# Altium schematic sheet Sheet1.SchDoc
size A
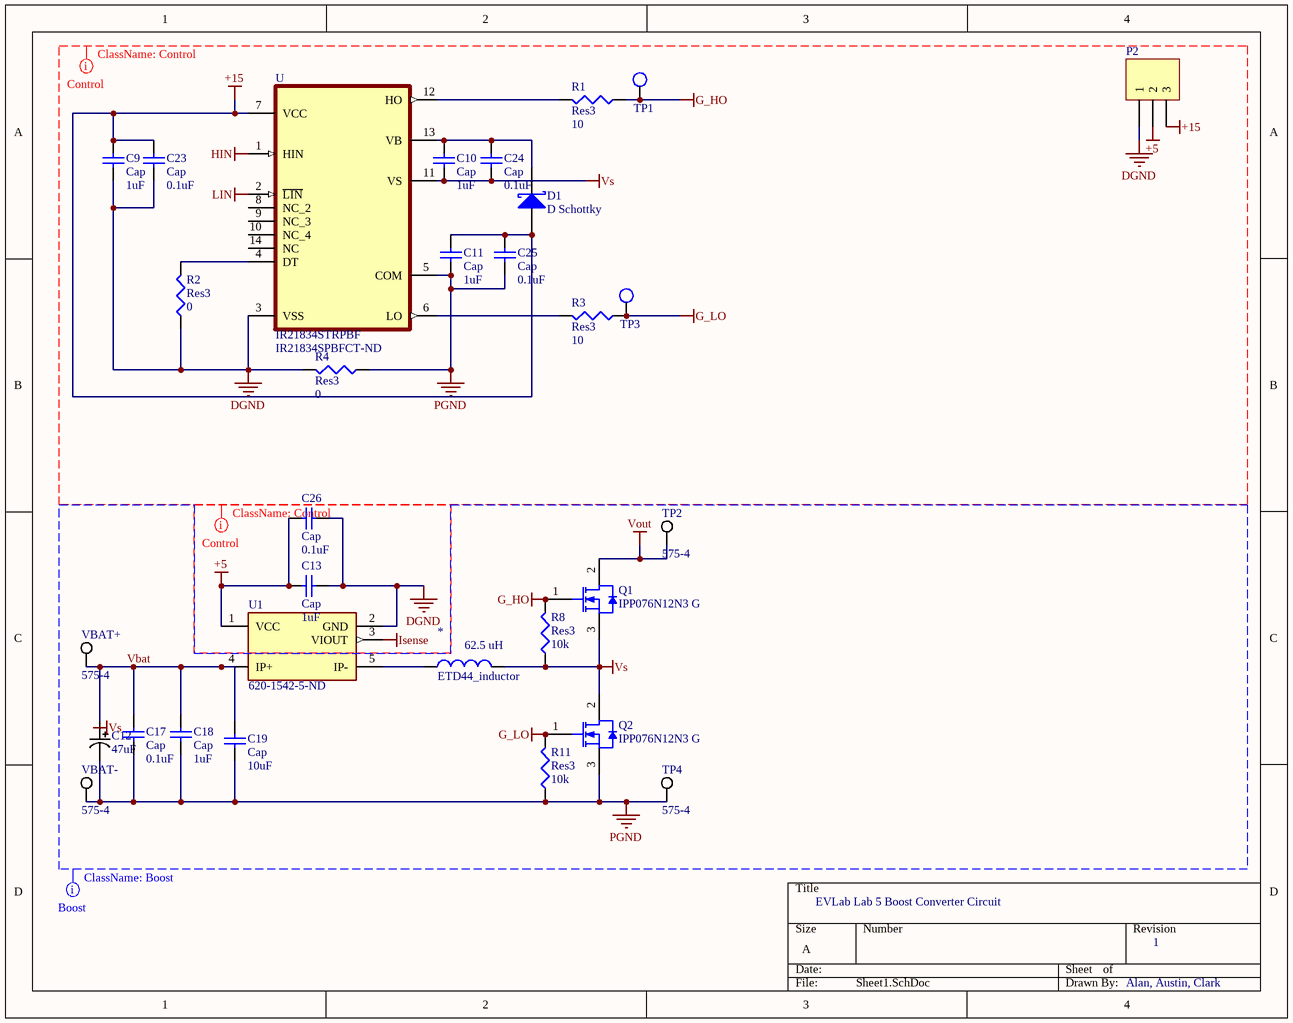
[diagram p0: Sheet1.SchDoc]

## Parts
*  ETD44_inductor  [ETD44]
C9  Cap  value 1uF  [C0603]
C10  Cap  value 1uF  [C0603]
C11  Cap  value 1uF  [C0603]
C12  47uF  [CAP_PC_10X10]
C13  Cap  value 1uF  [C0603]
C17  Cap  value 0.1uF  [C0603]
C18  Cap  value 1uF  [C0603]
C19  Cap  value 10uF  [C0603]
C23  Cap  value 0.1uF  [C0603]
C24  Cap  value 0.1uF  [C0603]
C25  Cap  value 0.1uF  [C0603]
C26  Cap  value 0.1uF  [C0603]
D1  D Schottky  [SMB]
P2  MHDR1X3  [MHDR1X3]  (value not drawn)
Q1  IPP076N12N3 G  [INF-PG-TO220-3-1_A_V]
Q2  IPP076N12N3 G  [INF-PG-TO220-3-1_A_V]
R1  Res3  value 10  [J1-0603]
R2  Res3  value 0  [J1-0603]
R3  Res3  value 10  [J1-0603]
R4  Res3  value 0  [J1-0603]
R8  Res3  value 10k  [J1-0603]
R11  Res3  value 10k  [J1-0603]
TP1  Test Point  [Test Point - TH]  (value not drawn)
TP2  575-4  [KSTN-575-4]
TP3  Test Point  [Test Point - TH]  (value not drawn)
TP4  575-4  [KSTN-575-4]
U  IR21834STRPBF  Supplier Part Number 3: IR21834SPBFCT-ND  [SOIC127P600X175-14N]
U1  Supplier Part Number 1: 620-1542-5-ND  [Allegro_MicroSystems_CB-PFF-5_0]  (hidden comment: ACS770KCB-150B-PFF-T)
VBAT+  575-4  [KSTN-575-4]
VBAT-  575-4  [KSTN-575-4]

## Nets
+5: C13.2 C26.2 P2.2 U1.1(VCC)
+15: C9.2 C11.2 C23.1 C25.1 D1.1(A) P2.3 U.7(VCC)
DGND: C9.1 C13.1 C23.2 C26.1 P2.1 R2.1 R4.2 U.3(VSS) U1.2(GND)
G_HO: Q1.1(GATE) R1.1 R8.2 TP1.1
G_LO: Q2.1(GATE) R3.1 R11.2 TP3.1
HIN: U.1(HIN)
Isense: U1.3(VIOUT)
LIN: U.2(~{LIN})
PGND: C11.1 C12.2 C17.1 C18.1 C19.1 C25.2 Q2.3(SOURCE) R4.1 R11.1 TP4.1 U.5(COM) VBAT-.1
Vout: Q1.2(DRAIN) TP2.1
Vs: *.2 C10.1 C24.2 Q1.3(SOURCE) Q2.2(DRAIN) R8.1 U.11(VS)
Vbat: C12.1 C17.2 C18.2 C19.2 U1.4(IP+) VBAT+.1
Net*_1: *.1 U1.5(IP-)
NetC10_2: C10.2 C24.1 D1.2(K) U.13(VB)
NetR1_2: R1.2 U.12(HO)
NetR2_2: R2.2 U.4(DT)
NetR3_2: R3.2 U.6(LO)

Not connected (* = marked no-connect by the designer): U 8(NC_2) 9(NC_3) 10(NC_4) 14(NC)

## Layout directives
net class Control: +5, +15, DGND, G_HO, G_LO, HIN, LIN, PGND, Vs
net class Boost: G_HO, G_LO, PGND, Vbat, Vout, Vs

## Notes on the sheet
- EVLab Lab 5 Boost Converter Circuit
- 1
- Alan, Austin, Clark
- Labels drawn without touching a wire or pin: Vs
- (in symbol ETD44_inductor) 62.5 uH

## Library data of the parts
C9-C11 C13 C17-C19 C23-C26 = Cap: Capacitor; Published: 8-Jun-2000; LatestRevisionDate: 17-Jul-2002; LatestRevisionNote: Re-released for DXP Platform.; PackageReference: RAD-0.3; Publisher: Altium Limited; PackageDescription: Radial Cap, Thru-Hole; 2 Leads; 0.3 in Pin Spacing
C12 = A767MU476M1KLAE040: CAP ALUM POLY 47UF 20% 80V SMD; Manufacturer_Part_Number: KEMET; Vendor: Nichicon; Built_By: EMA_Cory; Type: DEV; ESR (Equivalent Series Resistance): 40mR; Life (Hours): 2000Hour; Copyright: Copyright (C) 2018 Accelerated Designs. All rights reserved; RefDes: RefDes; Value: Value; Supplier 1: Digi-Key; Manufacturer: KEMET; Manufacturer Part Number: A767MU476M1KLAE040; RoHS: No; Stock 1: 1540; Pricing 1: 1=3.12000, 10=2.52600, 100=1.92890 (USD); Mount: Surface Mount; Case/Package: Radial; Min Operating Temperature: -55°C; Max Operating Temperature: 105°C; Packaging: Tape and Reel; Capacitance: 47uF; Tolerance: 20%; Voltage Rating: 80V; ComponentLink1URL: https://api.kemet.com/component-edge/download/datasheet/A767MU476M1KLAE040.pdf?src-supplier=Digi-Key; ComponentLink1Description: https://api.kemet.com/component-edge/download/datasheet/A767MU476M1KLAE040.pdf?src-supplier=Digi-Key; Supplier Part Number 1: 399-15651-1-ND; Category: Capacitors; ComponentLink2Description: SupplierDigikey; ComponentLink2URL: https://www.digikey.com/product-detail/en/kemet/A767MU476M1KLAE040/399-15651-6-ND/7392929
D1 = D Schottky: Schottky Diode; Published: 8-Jun-2000; LatestRevisionDate: 17-Jul-2002; LatestRevisionNote: Re-released for DXP Platform.; PackageReference: SMB; Publisher: Altium Limited; PackageDescription: DO-214-AA/SMB; 2 C-Bend Leads; Body 5.3 x 3.6 mm, inc. leads (LxW); Code_JEDEC: DO-214-AA
P2 = MHDR1X3: Header, 3-Pin; LatestRevisionDate: 17-Jul-2002; LatestRevisionNote: Re-released for DXP Platform.; Publisher: Altium Limited
Q1 Q2 = IPP076N12N3 G: N-Channel OptiMOS 3 Power-Transistor, 120 V VDS, 100 A ID, -55 to 175 degC, PG-TO220-3-1, Tube, Green; Manufacturer: Infineon; Green: TRUE; ID (max): 100 A; IDpuls (max): 400 A; Polarity: N; Ptot (max): 188 W; QG: 76 nC; RDS (on) (max): 7.6 mOhm; Rth: 0.8 K/W; RthJA (max): 62 K/W; VDS (max): 120 V; VGS(th) (max): 4 V; VGS(th) (min): 2 V; DatasheetVersion: Rev. 2.3; PackageVersion: Rev. 05, 08/2007; PackageReference: PG-TO220-3-1; PackageDescription: 3-Pin Plastic (Green) Transistor Single Outline Package, 10.03 x 8.98 mm Body, 2.54 mm Pitch; Supplier 1: Mouser; Supplier Part Number 1: 726-IPP076N12N3GXK; Supplier 2: Digi-Key; Supplier Part Number 2: IPP076N12N3 G-ND; Halogen-free: TRUE; Packing: Tube; RthJC (max): 0.8 K/W; Mounting Technology: Through Hole; PartNumber: IPP076N12N3 G; ComponentLink1Description: Manufacturer URL; ComponentLink1URL: http://www.infineon.com/; ComponentLink2Description: Datasheet; ComponentLink2URL: http://www.infineon.com/dgdl/IPP_I076N12N3+G_Rev2.3.pdf?folderId=db3a304313b8b5a60113cee8763b02d7&fileId=db3a30432239cccd0122a77a83ab7cd4; ComponentLink3Description: Package Specification; ComponentLink3URL: http://www.infineon.com/dgdl/IPP028N08N3_Rev1%5B1%5D.0.pdf?folderId=db3a304313b8b5a60113cee8763b02d7&fileId=db3a30432313ff5e0123a3c08e7326b5
R1-R4 R8 R11 = Res3: Resistor; Published: 8-Jun-2000; LatestRevisionDate: 29-May-2009; LatestRevisionNote: IPC-7351 Footprint Added.; PackageReference: J1-0603; Publisher: Altium Limited; PackageDescription: Chip Resistor
TP2 TP4 VBAT+ VBAT- = CMP-2000-05649-1: Banana Jack, Non-Insulated, 1-Pin THD, RoHS, Bulk; Manufacturer: Keystone-Electronics; Package Version: Rev. B, 11/1994; Plug/Mating Plug Diameter: StandardBanana; Gender: Female; Package Reference: 575-4; Operating Temperature: -; Contact Material: Brass; Packaging: Bulk; Series: -; Category: Connectors,Interconnects; Color: -; Type: BananaJack; Contact Finish: Nickel; Features: -; Family: BananaandTipConnectors-Jacks,Plugs; Body Material: -; Manufacturer URL: http://www.keyelco.com/; Termination: Solder; Insulation: Non-Insulated; Datasheet Version: Rev. B, 11/1994; Mounting Technology: ThroughHole; Package URL: http://www.keyelco.com/product-pdf.cfm?p=2379; Mounting Type: ThroughHole; Package Description: 1-Pin Through Hole Device, Dia 7.92 mm; Datasheet URL: http://www.keyelco.com/product-pdf.cfm?p=2379; Wire Gauge: -; ComponentLink1Description: SupplierDigikey; ComponentLink1URL: https://www.digikey.com/product-detail/en/keystone-electronics/575-4/36-575-4-ND/318493
U = IR21834STRPBF: INTERNATIONAL RECTIFIER   IR21834STRPBF   MOSFET DRIVER, HALF BRIDGE, SOIC-14, FULL REEL; Manufacturer Part Number: IR2183STRPBF; MF: Infineon Technologies; Turn-On Delay Time: 35ns; Max Supply Voltage: 20V; Min Supply Voltage: 10V; Number of Outputs: 2; Turn-Off Delay Time: 220ns; Power Dissipation: 625mW; Max Supply Current: 1.6mA; Max Output Current: 2.3A; Rise Time: 60ns; Propagation Delay: 330ns; Output Current: 1.9A; Nominal Supply Current: 1mA; Digi-Key_Purchase_URL: https://www.digikey.com/product-detail/en/infineon-technologies/IR21834STRPBF/IR21834SPBFCT-ND/827949?utm_source=snapeda&utm_medium=aggregator&utm_campaign=symbol; SnapEDA_Link: https://www.snapeda.com/parts/IR21834STRPBF/Infineon%20Technologies/view-part/528919/?ref=snap; MP: IR21834STRPBF; Digi-Key_Part_Number: IR21834SPBFCT-ND; Value: *; Package: SOIC-14 Infineon; Supplier 1: Digi-Key; Manufacturer: International Rectifier; RoHS: Yes; Category: MOSFETs; Stock 1: 12591; Pricing 1: 1=3.18000, 10=2.85300, 25=2.69760, 100=2.21800, 250=1.99016, 500=1.91824, 1000=1.59454 (USD); Mount: Surface Mount; Case/Package: SOIC; Number of Pins: 8; Weight: 0.019048oz; Min Operating Temperature: -40°C; Max Operating Temperature: 125°C; Number of Drivers: 2; Fall Time: 35ns; Packaging: Tape and Reel; Max Power Dissipation: 625mW; Package Quantity: 1; Operating Supply Current: 1.6mA; Radiation Hardening: No; REACH SVHC: No SVHC; Supplier 2: Digi-Key; Stock 2: 6093; Pricing 2: 1=3.19000, 10=2.86600, 25=2.70960, 100=2.22780, 250=1.99896, 500=1.92672, 1000=1.60159 (USD); Output Voltage: 20V; Length: 8.74mm; Height: 1.5mm; Width: 3.99mm; Supplier 3: Digi-Key; ComponentLink1Description: SupplierDigikey; ComponentLink1URL: https://www.digikey.com/product-detail/en/infineon-technologies/IR21834STRPBF/IR21834SPBFCT-ND/827949; ComponentLink2Description: Datasheet; ComponentLink2URL: https://www.infineon.com/dgdl/ir2183.pdf?fileId=5546d462533600a4015355c9490e16d1; ComponentLink3Description: application note; ComponentLink3URL: https://www.infineon.com/dgdl/Infineon-Using_Monolithic_Voltage_Gate_Drivers-AN-v01_00-EN.pdf?fileId=5546d462584d1d4a01585242c11947b1
U1 = ACS770KCB-150B-PFF-T: ALLEGRO MICROSYSTEMS - ACS770LCB-050U-PFF-T - HIGH PRECISION LINEAR CURRENT SENSOR ROHS COMPLIANT: YES; Number of Channels: 1; Polarity: Unidirectional; Current Sensing: 50A; Sensitivity: 80mV/A; Frequency: 120kHz; Linearity: 1%; Accuracy: 0.6%; Response Time: 4.6us; Max Supply Current: 15mA; Supplier 1: Digi-Key; Manufacturer: Allegro MicroSystems; Manufacturer Part Number: ACS770LCB-050U-PFF-T; RoHS: No; Category: Current Sensors; Stock 1: 4174; Pricing 1: 1=7.18000, 5=6.30000, 10=5.67000, 25=5.04000, 50=4.66200, 100=4.03200, 500=3.78000, 1000=3.52800 (USD); Mount: Through Hole; Min Operating Temperature: -40°C; Max Operating Temperature: 150°C; Packaging: Rail/Tube; ComponentLink1URL: https://www.allegromicro.com/~/media/Files/Datasheets/ACS770-Datasheet.pdf?src-supplier=Digi-Key; ComponentLink1Description: Digikey Datasheet; ComponentLink2URL: http://www.farnell.com/datasheets/2838159.pdf?src-supplier=Newark; ComponentLink2Description: Newark Datasheet; ComponentLink3Description: SupplierDigikey; ComponentLink3URL: https://www.digikey.com/product-detail/en/allegro-microsystems/ACS770LCB-050U-PFF-T/620-1542-5-ND/4473981
* = ETD44_inductor: ComponentLink1Description: DigikeyDistributer; ComponentLink1URL: https://www.digikey.com/product-detail/en/tdk-electronics-inc/B66366B1018T001/495-5481-ND/3914838